# EAGLE design working (EAGLE 6.4)
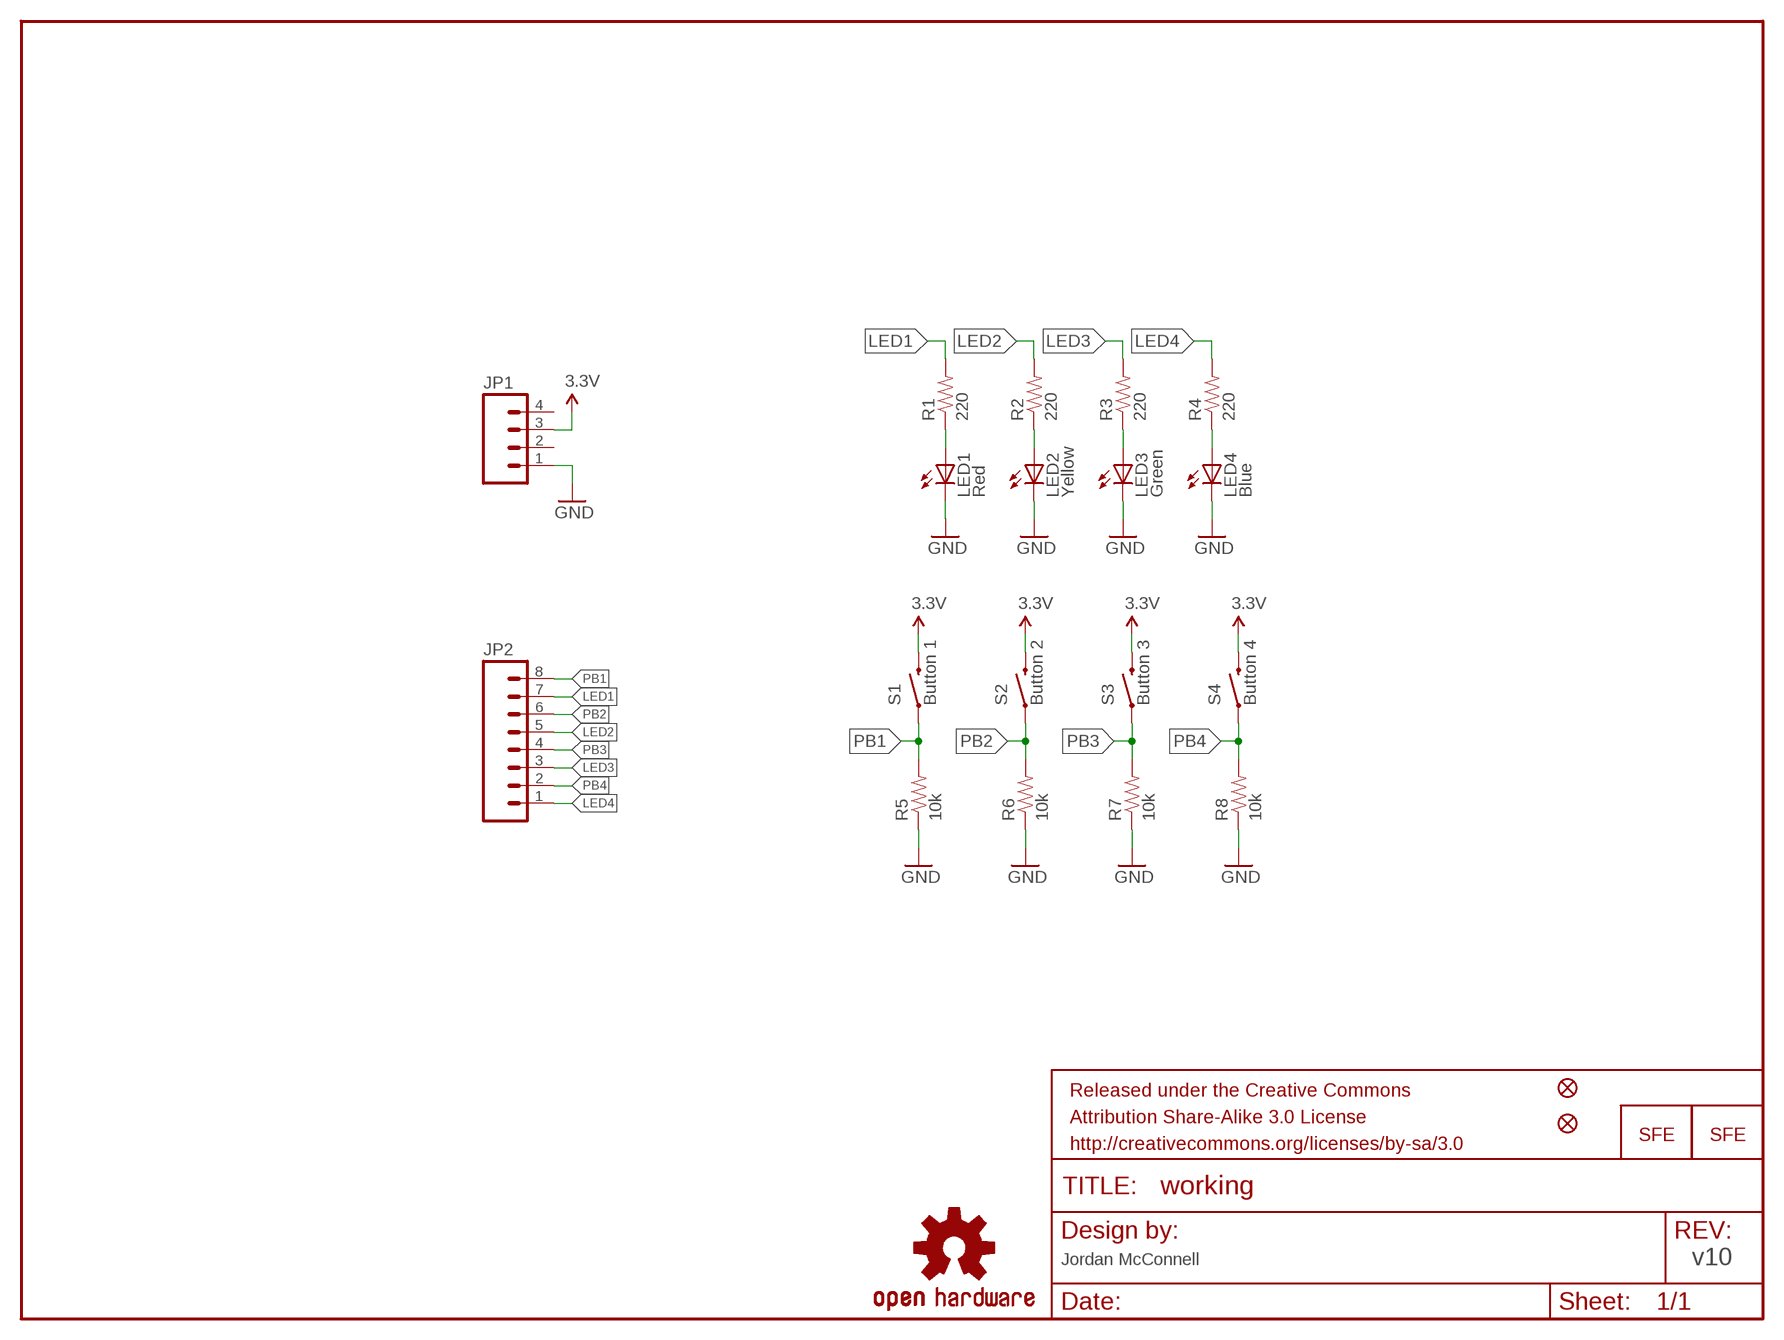
[diagram p0: schematic, sheet 1]

## Parts
FRAME1  FRAME-LETTER  [CREATIVE_COMMONS]
JP1  M04PTH  [1X04]
JP2  M081X08  [1X08]
JP3  LOGO-SFESK  [SFE-LOGO-FLAME]
JP4  LOGO-SFENEW  [SFE-NEW-WEBLOGO]
JP5  FIDUCIALUFIDUCIAL  [MICRO-FIDUCIAL]
JP6  FIDUCIALUFIDUCIAL  [MICRO-FIDUCIAL]
LED1  Red  LED0603  [LED-0603]
LED2  Yellow  LED0603  [LED-0603]
LED3  Green  LED0603  [LED-0603]
LED4  Blue  LED0603  [LED-0603]
R1  220  RESISTOR0402-RES  [0402-RES]
R2  220  RESISTOR0402-RES  [0402-RES]
R3  220  RESISTOR0402-RES  [0402-RES]
R4  220  RESISTOR0402-RES  [0402-RES]
R5  10k  RESISTOR0402-RES  [0402-RES]
R6  10k  RESISTOR0402-RES  [0402-RES]
R7  10k  RESISTOR0402-RES  [0402-RES]
R8  10k  RESISTOR0402-RES  [0402-RES]
S1  Button 1  SWITCH-MOMENTARY-2SMD  [TACTILE_SWITCH_SMD]
S2  Button 2  SWITCH-MOMENTARY-2SMD  [TACTILE_SWITCH_SMD]
S3  Button 3  SWITCH-MOMENTARY-2SMD  [TACTILE_SWITCH_SMD]
S4  Button 4  SWITCH-MOMENTARY-2SMD  [TACTILE_SWITCH_SMD]
U$1  OSHW-LOGOS  [OSHW-LOGO-S]

## Nets
3.3V: JP1.3 S1.3 S2.3 S3.3 S4.3
GND: JP1.1 LED1.C LED2.C LED3.C LED4.C R5.1 R6.1 R7.1 R8.1
LED1: JP2.7 R1.2
LED2: JP2.5 R2.2
LED3: JP2.3 R3.2
LED4: JP2.1 R4.2
N$1: LED1.A R1.1
N$4: LED3.A R3.1
N$5: LED2.A R2.1
N$6: LED4.A R4.1
PB1: JP2.8 R5.2 S1.1
PB2: JP2.6 R6.2 S2.1
PB3: JP2.4 R7.2 S3.1
PB4: JP2.2 R8.2 S4.1
Unconnected: JP1.2 JP1.4

## Notes on the sheet
- Jordan McConnell | v10

## Library data of the parts
FRAME1 = SparkFun-Aesthetics:FRAME-LETTER: Schematic Frame Standard 8.5x11 US Letter frame
JP1 = SparkFun-Connectors:M04: Header 4 Standard 4-pin 0.1" header. Use with straight break away headers (SKU : PRT-00116), right angle break away headers (PRT-00553), swiss pins (PRT-00743), machine pins (PRT-00117), and female headers (PRT-00115). Molex polarized connector foot print use with SKU : PRT-08231 with associated crimp pins and housings. 1MM SMD Version SKU: PRT-10208
JP2 = SparkFun-Connectors:M08: Header 8 Standard 8-pin 0.1" header. Use with straight break away headers (SKU : PRT-00116), right angle break away headers (PRT-00553), swiss pins (PRT-00743), machine pins (PRT-00117), and female headers (PRT-00115).
JP3 JP4 = SparkFun-Aesthetics:LOGO-SFE: Spark Fun Electronics PCB Logo This is the standard Spark Fun Electronics PCB logo.
JP5 JP6 = SparkFun:FIDUCIAL: Fiducial Alignment Points Various fiducial points for machine vision alignment.
LED1-LED4 = SparkFun-LED:LED: LEDs Standard schematic elements and footprints for 5mm, 3mm, 1206, and 0603 sized LEDs. 5mm - Spark Fun Electronics SKU : COM-00529 (and others)
R1-R8 = SparkFun-Passives:RESISTOR: Resistor Basic schematic elements and footprints for 0603, 1206, and PTH resistors.
S1-S4 = SparkFun-Electromechanical:SWITCH-MOMENTARY-2: Various NO switches- pushbuttons, reed, etc
U$1 = SparkFun-Aesthetics:OSHW-LOGO: Open Source Hardware Logo This logo indicates the piece of hardware it is found on incorporates a OSHW license and/or adheres to the definition of open source hardware found here: http://freedomdefined.org/OSHW

## Board
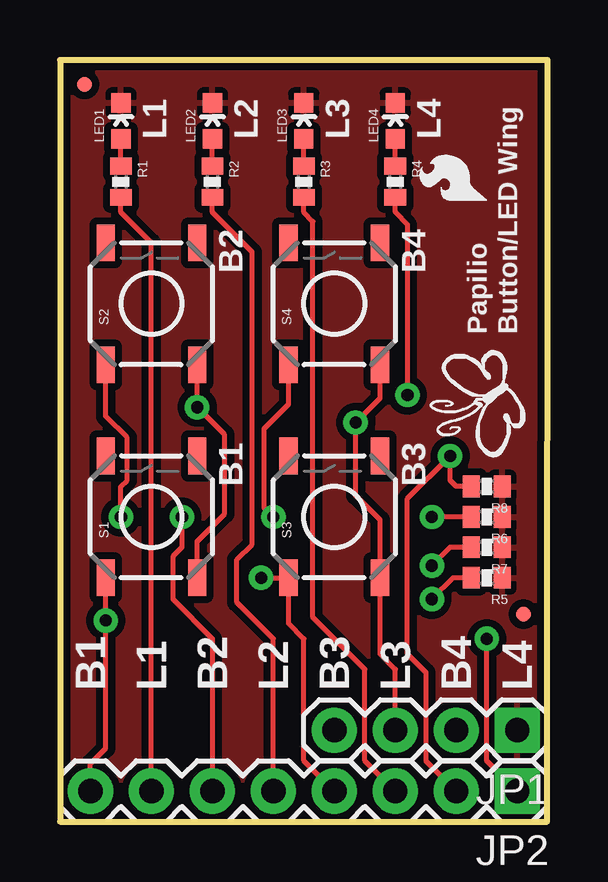
[diagram p1: board, top side]
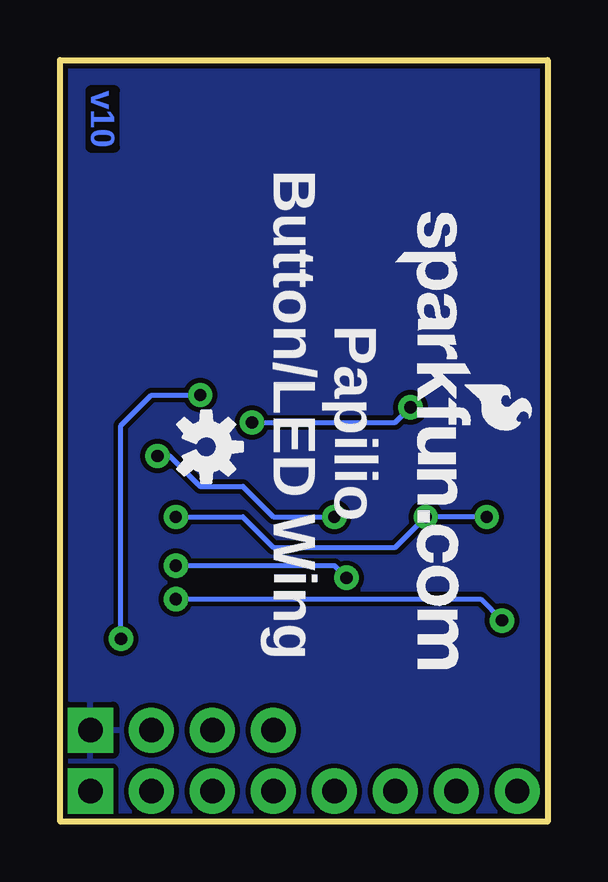
[diagram p2: board, bottom side, seen from below]

Size 20.32 x 31.75 mm. Coordinates in mm from the lower left corner, seen from the top.
Outline: 0,0 20.3,0 20.32,31.75 0,31.75 0,0
Copper layers (1*16): Top 0.035mm / dielectric 1.5mm / Bottom 0.035mm
Design rules "default": minimum track width 8mil, minimum drill 20mil, track to track 8mil, track to pad 8mil, pad to pad 8mil, via to via 8mil, smd to smd 8mil, copper to edge 8mil, drill to drill 8mil, minimum pad ring 12mil, minimum via ring 10mil, stop-mask expansion 4mil, vias tented up to drill 20mil, thermal gap 10mil

### Footprints (pad centres in the part's own frame; a part is rotated, then mirrored left to right if it is on the bottom)
1X04 = drill 1.016 pad 1.88 square: 1 0,0 | drill 1.016 pad 1.88: 2 2.54,0; 3 5.08,0; 4 7.62,0
1X08 = drill 1.016 pad 1.88 square: 1 0,0 | drill 1.016 pad 1.88: 2 2.54,0; 3 5.08,0; 4 7.62,0; 5 10.16,0; 6 12.7,0; 7 15.24,0; 8 17.78,0
MICRO-FIDUCIAL = smd 0.635 x 0.635: 1 0,0
LED-0603 = smd 0.8 x 0.8: A 0,-0.75; C 0,0.75
0402-RES = smd 0.7 x 0.9: 1 -0.65,0; 2 0.65,0
TACTILE_SWITCH_SMD = smd 1.524 x 0.762: 1 -2.54,1.905; 2 2.54,1.905; 3 -2.54,-1.905; 4 2.54,-1.905

### Placement (x,y rotation side)
FRAME1  -3.81,-11.43 0 top  (outside the outline)
JP1  19.05,3.81 180 top
JP2  19.05,1.27 180 top
JP3  17.78,25.91 90 top
JP4  6.35,25.4 270 bottom
JP5  1.02,30.73 0 top
JP6  19.3,8.64 0 top
LED1  2.54,29.21 0 top
LED2  6.35,29.21 0 top
LED3  10.16,29.21 0 top
LED4  13.97,29.21 0 top
R1  2.54,26.67 270 top
R2  6.35,26.67 270 top
R3  10.16,26.67 270 top
R4  13.97,26.67 270 top
R5  17.78,10.16 180 top
R6  17.78,12.7 180 top
R7  17.78,11.43 180 top
R8  17.78,13.97 180 top
S1  3.81,12.7 90 top
S2  3.81,21.59 90 top
S3  11.43,12.7 90 top
S4  11.43,21.59 90 top
U$1  14.22,15.62 270 bottom

### Tracks (layer width: path | path; a pad name or v marks a point on that pad's centre or on a via)
3.3V  (via drill 0.51)
  Top 0.203: JP1.3 13.97,6.35 13.34,6.99 S3.3 13.34,12.57 12.32,13.59 v12.32,16.64 13.34,17.65 S4.3 | S2.3 v5.71,17.27 6.86,16.13 6.86,12.83 5.71,11.68 S1.3
  Bottom 0.203: v12.32,16.64 6.35,16.64 v5.71,17.27
GND
  pour Top (isolate 0.305): 0,0 0,31.75 20.32,31.75 20.32,0
  pour Bottom: 0,0 0,31.75 20.32,31.75 20.32,0
LED1
  Top 0.203: JP2.7 3.81,24.13 2.54,25.4 R1.2
LED2
  Top 0.203: JP2.5 8.89,7.62 7.37,9.14 7.37,10.92 8,11.56 8,23.75 6.35,25.4 R2.2
LED3
  Top 0.203: JP2.3 12.7,2.54 12.7,6.35 10.54,8.51 10.54,25.02 10.16,25.4 R3.2
LED4  (via drill 0.51)
  Top 0.203: JP2.1 17.78,2.54 v17.78,7.62 | R4.2 13.97,25.4 14.48,24.89 v14.48,17.78
  Bottom 0.203: v17.78,7.62 17.78,16.51 16.51,17.78 v14.48,17.78
N$1
  Top 0.203: R1.1 LED1.A
N$4
  Top 0.203: R3.1 LED3.A
N$5
  Top 0.203: R2.1 LED2.A
N$6
  Top 0.203: R4.1 LED4.A
PB1  (via drill 0.51)
  Top 0.203: JP2.8 1.27,2.41 1.91,3.05 v1.91,8.38 S1.1 | R5.2 16.38,10.16 v15.49,9.27
  Bottom 0.203: v15.49,9.27 2.79,9.27 v1.91,8.38
PB2  (via drill 0.51)
  Top 0.203: v5.08,12.7 5.08,11.43 4.7,11.05 4.7,9.27 6.35,7.62 JP2.6 | R6.2 v15.49,12.7 | v2.54,12.7 2.54,13.97 2.79,14.22 2.79,16 1.91,16.89 S2.1
  Bottom 0.203: v2.54,12.7 v5.08,12.7 6.35,11.43 11.43,11.43 12.7,12.7 v15.49,12.7
PB3  (via drill 0.51)
  Top 0.203: JP2.4 10.16,2.54 10.16,7.62 9.53,8.26 S3.1 v8.38,10.16 | R7.2 16.26,11.43 v15.49,10.67
  Bottom 0.203: v15.49,10.67 8.89,10.67 v8.38,10.16
PB4  (via drill 0.51)
  Top 0.203: JP2.2 15.24,2.54 15.24,6.22 14.48,6.99 14.48,13.46 v16.26,15.24 16.26,14.22 16.51,13.97 R8.2 | v8.89,12.7 8.51,13.08 8.51,16.38 9.53,17.4 S4.1
  Bottom 0.203: v8.89,12.7 11.43,12.7 12.7,13.97 14.48,13.97 15.75,15.24 v16.26,15.24

### Text on the board
Bottom: v10
tPlace: L1 | L2 | L3 | L4 | B2 | B4 | Papilio | Button/LED Wing | B1 | B3 | B1 | L1 | B2 | L2 | B3 | L3 | B4 | L4
bPlace: Button/LED Wing | Papilio
tValues: Jordan McConnell